# Altium schematic sheet LCC Resonant Charging Board.SchDoc
size A4
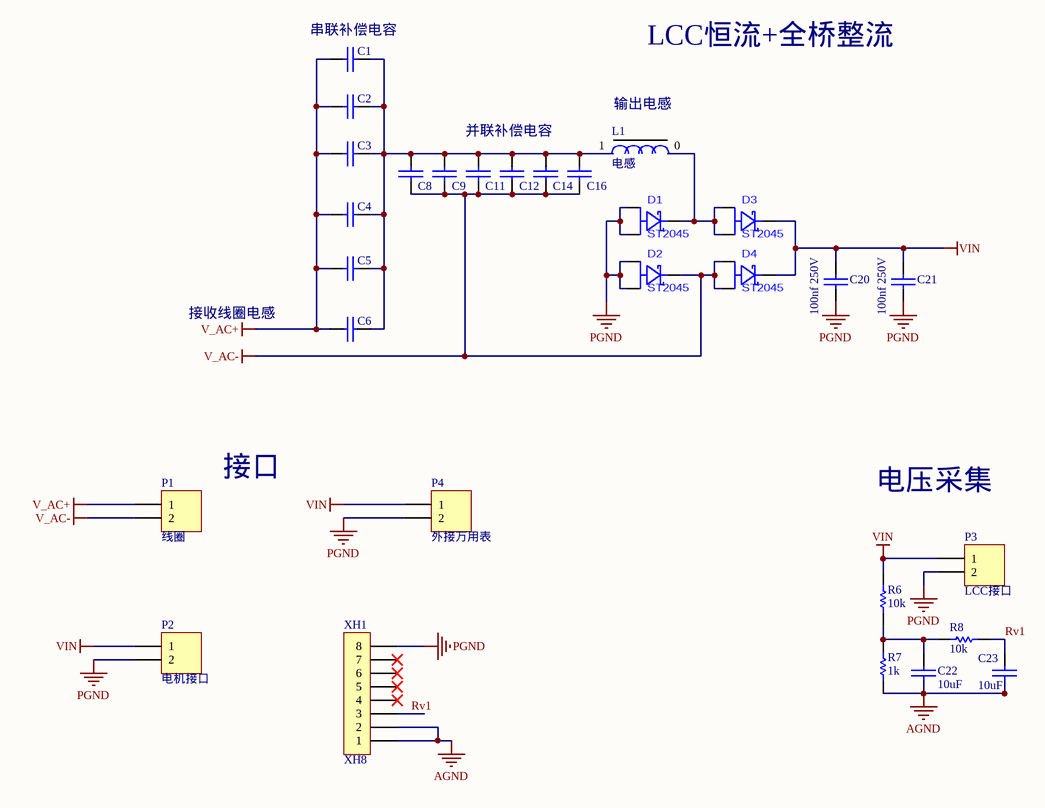
[diagram p0: LCC Resonant Charging Board.SchDoc]

## Parts
C1  (no value)  [1206C]
C2  (no value)  [1206C]
C3  (no value)  [1206C]
C4  (no value)  [1206C]
C5  (no value)  [1206C]
C6  (no value)  [1206C]
C8  (no value)  [1206C]
C9  (no value)  [1206C]
C11  (no value)  [1206C]
C12  (no value)  [1206C]
C14  (no value)  [1206C]
C16  (no value)  [1206C]
C20  100nf 250V  [1206C]
C21  100nf 250V  [1206C]
C22  10uF  [0603C]
C23  10uF  [0603C]
D1  ST2045  [FM10U100]
D2  ST2045  [FM10U100]
D3  ST2045  [FM10U100]
D4  ST2045  [FM10U100]
L1  电感  [lcc电感]
P1  线圈  [线圈接口]
P2  电机接口  [XT30U-M]
P3  LCC接口  [XT30U-M]
P4  外接万用表  [HDR1X2]
R6  10k  [0402R]
R7  1k  [0402R]
R8  10k  [0402R]
XH1  XH8  [XH8/2.54mm/180]

## Nets
AGND: C22.1 C23.1 R7.1 XH1.1 XH1.2
PGND: C20.1 C21.1 D1.1(A) D1.3(A) D2.1(A) D2.3(A) P2.2 P3.2 P4.2 XH1.8
V_AC+: C1.1 C2.1 C3.1 C4.1 C5.1 C6.2 P1.1
V_AC-: C8.1 C9.1 C11.2 C12.1 C14.1 C16.1 D2.2(K) D4.1(A) D4.3(A) P1.2
VIN: C20.2 C21.2 D3.2(K) D4.2(K) P2.1 P3.1 P4.1 R6.2
Rv1: C23.2 R8.1 XH1.3
NetC1_2: C1.2 C2.2 C3.2 C4.2 C5.2 C6.1 C8.2 C9.2 C11.1 C12.2 C14.2 C16.2 L1.1
NetC22_2: C22.2 R6.1 R7.2 R8.2
NetD1_2: D1.2(K) D3.1(A) D3.3(A) L1.0

Not connected (* = marked no-connect by the designer): XH1 4* 5* 6* 7*

## Notes on the sheet
- (near C1) 串联补偿电容
- LCC恒流+全桥整流
- 并联补偿电容
- 输出电感
- 接收线圈电感
- 接口
- 电压采集

## Library data of the parts
C1-C6 C8 C9 C11 C12 C14 C16 C20-C23 = CAP: 无极性电容
P1-P4 = Header 2: Header, 2-Pin; LatestRevisionDate: 17-Jul-2002; LatestRevisionNote: Re-released for DXP Platform.; Publisher: Altium Limited
R6-R8 = RES